# EAGLE design MRCS-555-Tone-Generator (EAGLE 7.7.0)
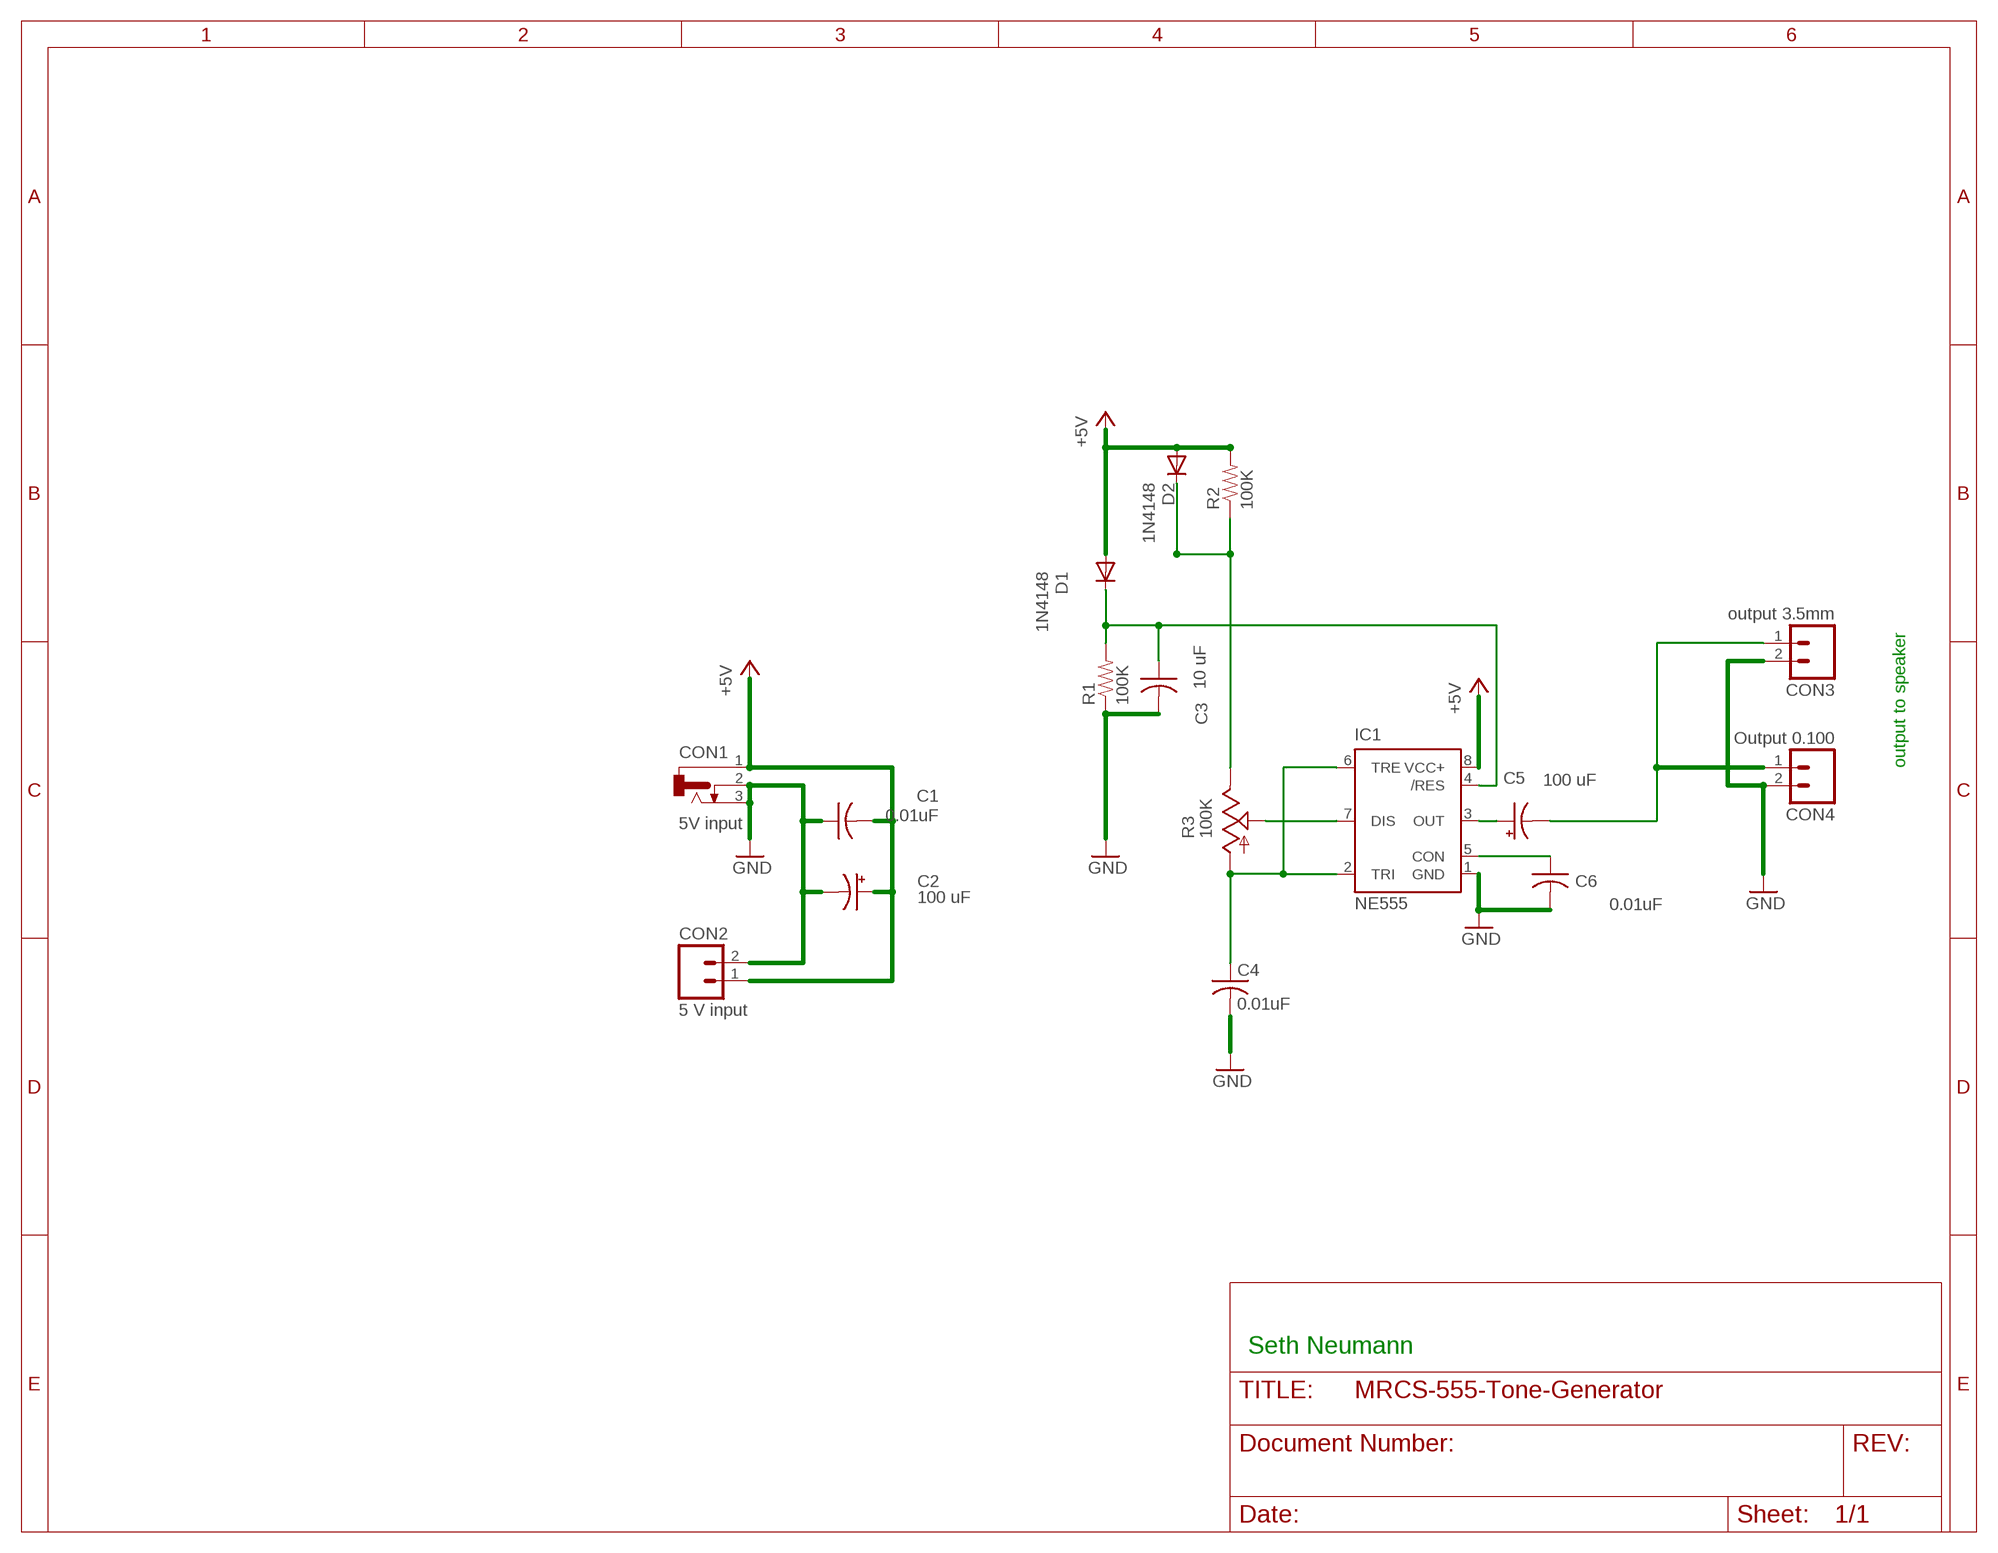
[diagram p0: schematic, sheet 1]

## Parts
C1  0.01uF  CAPPTH2  [C-PTH-0.100]
C2  100 uF  CAP-POLPTH-3.5MM  [E3.5-10]
C3  10 uF  CAPPTH2  [C-PTH-0.100]
C4  0.01uF  CAPPTH2  [C-PTH-0.100]
C5  100 uF  CAP-POLPTH-3.5MM  [E3.5-10]
C6  0.01uF  CAPPTH2  [C-PTH-0.100]
CON1  5V input  CONNECTOR-DC-POWER-RA  [DCJ0202]
CON2  5 V input  CONNECTOR-M021X02-LOCK  [1X02_LOCK]
CON3  output 3.5mm  CONNECTOR-M023.5MM-LOCK  [SCREWTERMINAL-3.5MM-2_LOCK]
CON4  Output 0.100  CONNECTOR-M021X02-LOCK  [1X02_LOCK]
D1  1N4148  DIODE1N4148  [DIODE-1N4148]
D2  1N4148  DIODE1N4148  [DIODE-1N4148]
IC1  NE555  NE555P  [DIL-08]
R1  100K  RPTH04  [AXIAL-0.4-RES]
R2  100K  RPTH04  [AXIAL-0.4-RES]
R3  100K  TRIM_US-RS3  [RS3]

## Nets
+5V: C1.2 C2.+ CON1.1 CON2.1(A) D1.A D2.A IC1.8(VCC+) R2.P$2
GND: C1.1 C2.- C3.2 C4.2 C6.2 CON1.2 CON1.3 CON2.2(B) CON3.2(B) CON4.2(B) IC1.1(GND) R1.P$1
N$1: C5.- CON3.1(A) CON4.1(A)
N$2: C6.1 IC1.5(CON)
N$3: C5.+ IC1.3(OUT)
N$4: C4.1 IC1.2(TRI) IC1.6(TRE) R3.A
N$5: D2.C R2.P$1 R3.E
N$6: C3.1 D1.C IC1.4(/RES) R1.P$2
N$7: IC1.7(DIS) R3.S

## Notes on the sheet
- output to speaker
- Seth Neumann

## Library data of the parts
C1 C3 C4 C6 = SPCoast:CAP*
C2 C5 = SPCoast:CAP-POL*
CON1 = SPCoast:CONNECTOR-DC-POWER: DC POWER JACK
CON2-CON4 = SPCoast:CONNECTOR-M02: PHOENIX CONNECTOR
D1 D2 = SPCoast:DIODE: Diode These are standard reverse protection diodes and small signal diodes. SMA package can handle up to about 1A. SOD-323 can handle about 200mA. What the SOD-323 package when ordering, there are some mfgs out there that are 5-pin packages.
IC1 = SPCoast:NE555: General purpose bipolar Timer; MF: Arrow Electronics; MPN: NE555N; OC_FARNELL: 1467742; OC_NEWARK: 89K1486
R1 R2 = SPCoast:R*: Resistor Basic schematic elements and footprints for 0603, 1206, and PTH 1/10th watt (small) resistors.
R3 = MRCS:TRIM_US-: POTENTIOMETER

## Board
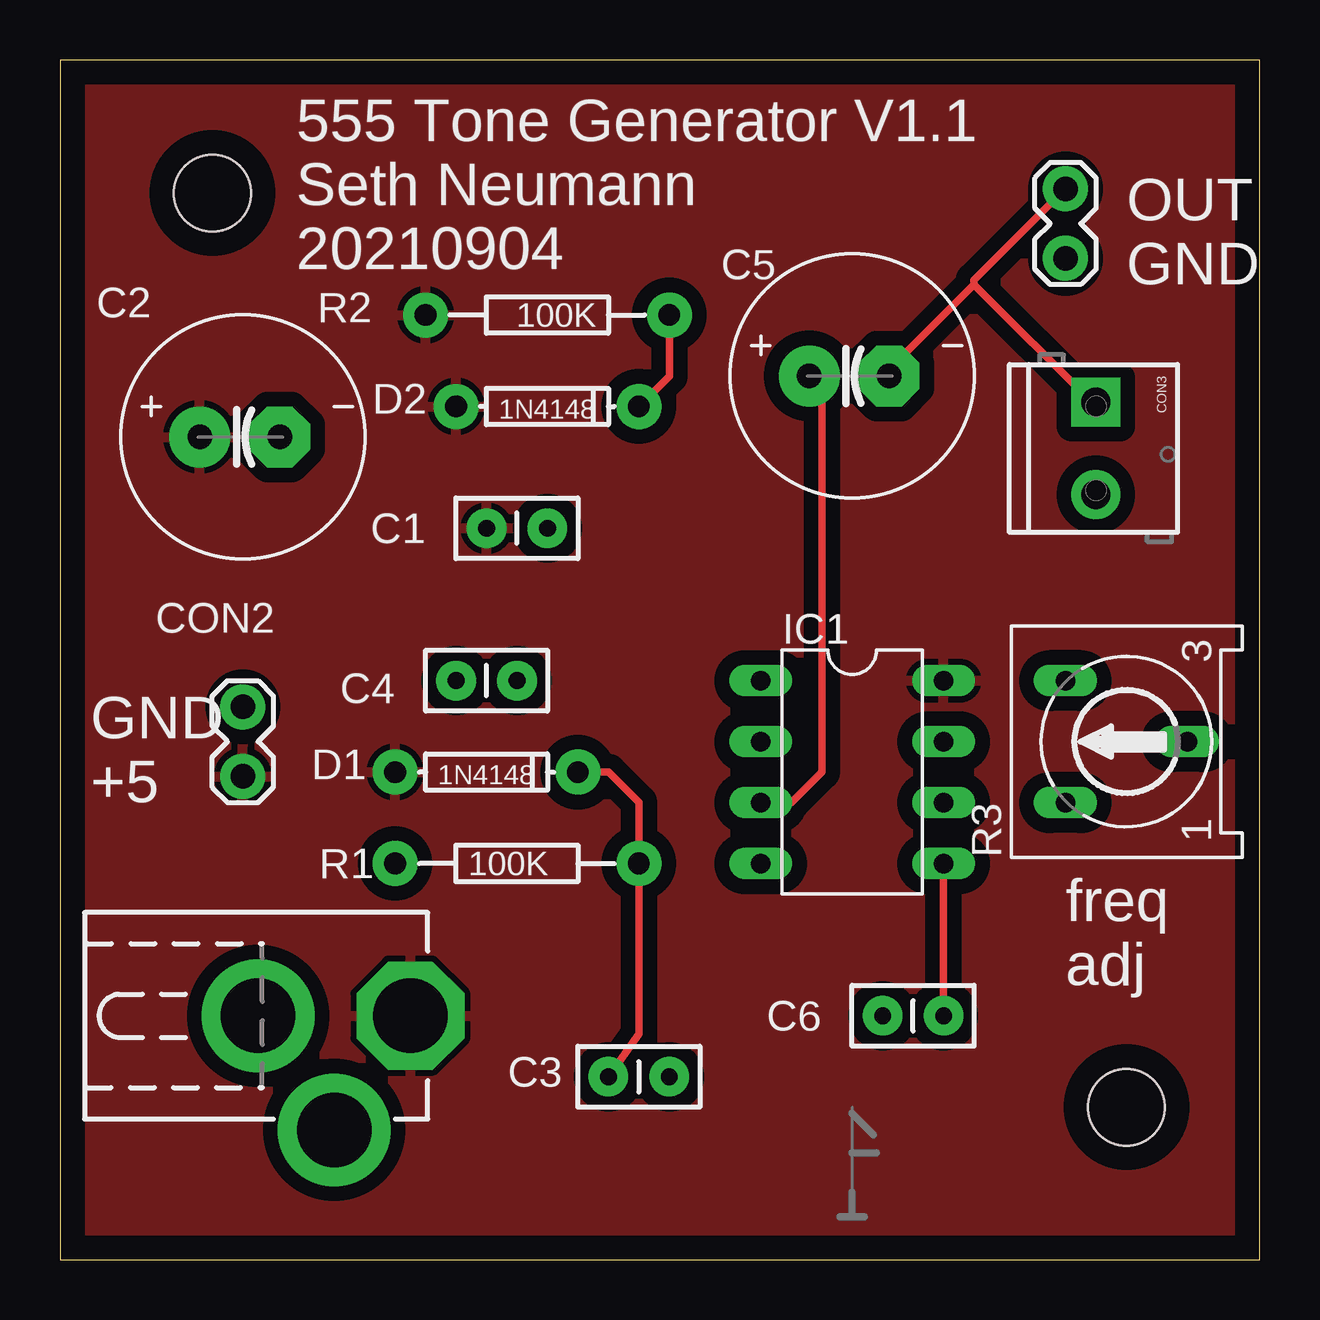
[diagram p1: board, top side]
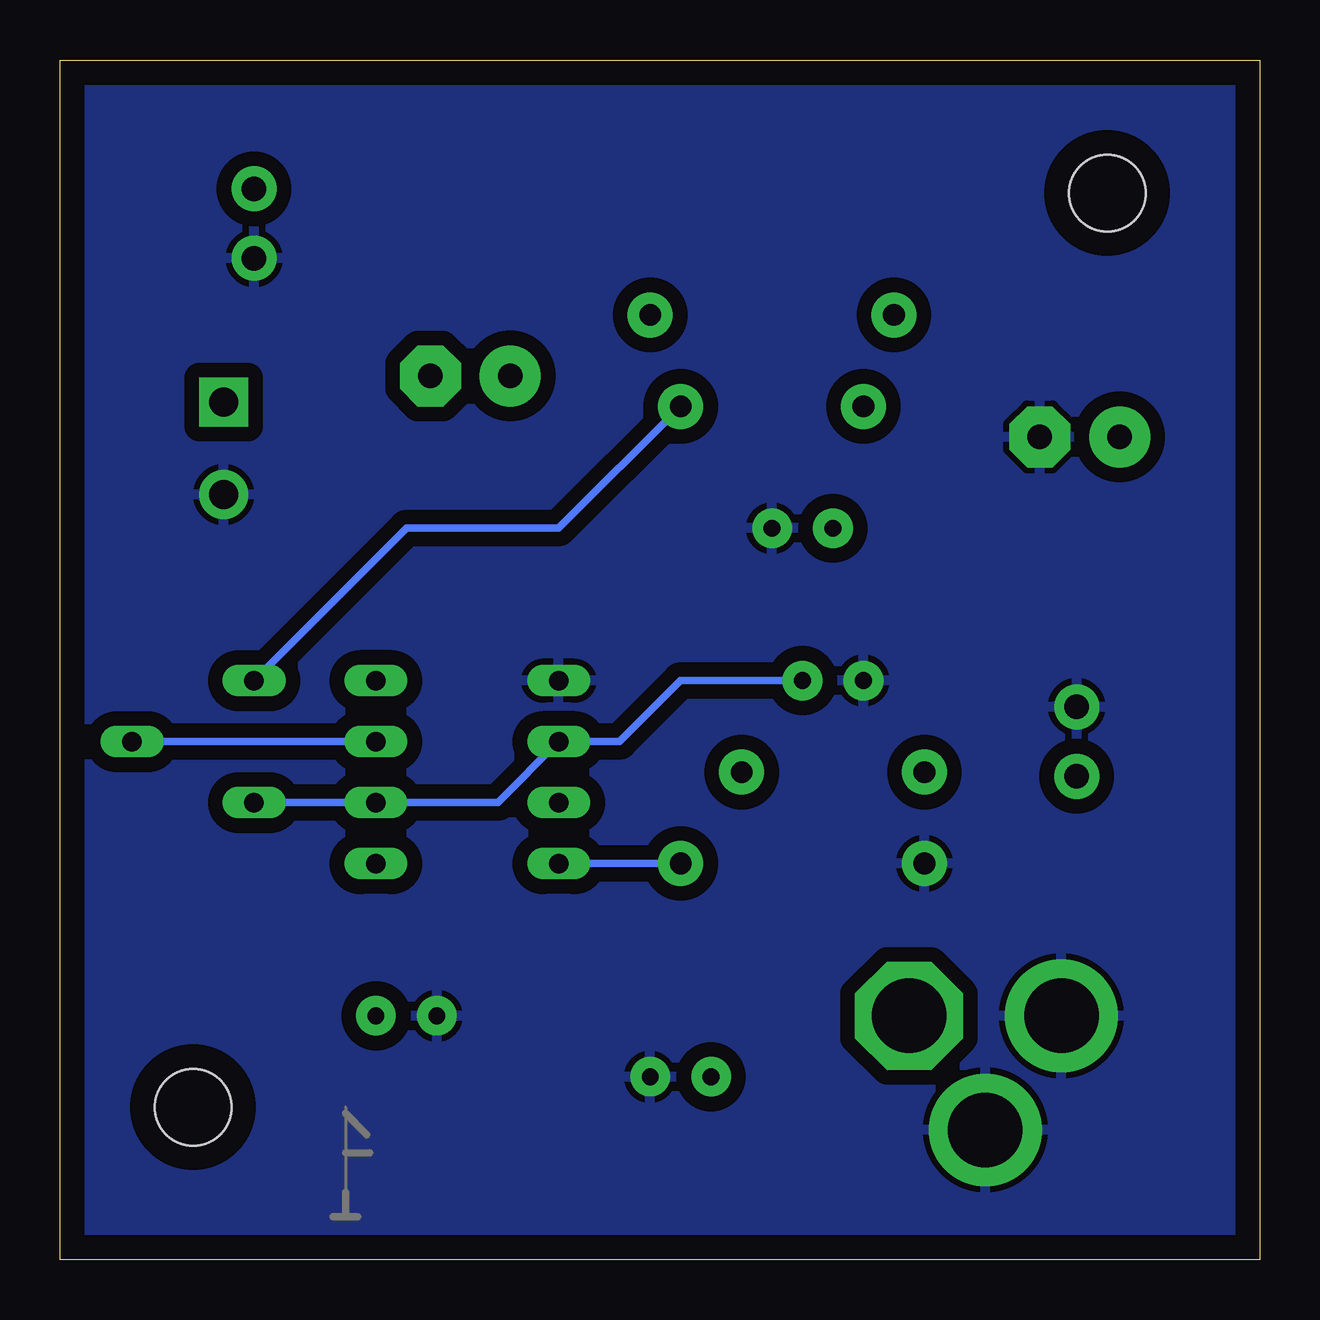
[diagram p2: board, bottom side, seen from below]

Size 50 x 50 mm. Coordinates in mm from the lower left corner, seen from the top.
Outline: 0,0 50,0 50,50 0,50 0,0
Copper layers (1*16): Top 0.035mm / dielectric 1.5mm / Bottom 0.035mm
Design rules "default": minimum track width 10mil, minimum drill 24mil, track to track 8mil, track to pad 8mil, pad to pad 8mil, via to via 8mil, smd to smd 8mil, copper to edge 40mil, drill to drill 8mil, minimum pad ring 10mil, minimum via ring 8mil, stop-mask expansion 4mil, vias tented up to drill 0mil, thermal gap 10mil
Holes 3.2 mm at 6.35,44.45 44.45,6.35

### Footprints (pad centres in the part's own frame; a part is rotated, then mirrored left to right if it is on the bottom)
C-PTH-0.100 = drill 0.7 pad 1.651: 1 -1.27,0; 2 1.27,0
E3.5-10 = drill 1.016 pad 2.54: + -1.79,0 | drill 1.016 pad 2.54 octagon: - 1.54,0
DCJ0202 = drill 3.1 pad 4.5 octagon: 1 0,3.175 | drill 3.1 pad 4.7: 2 4.763,0; 3 0,-3.175
1X02_LOCK = drill 1.016 pad 1.88: 1 -0.178,0; 2 2.718,0
SCREWTERMINAL-3.5MM-2_LOCK = drill 1.2 pad 2.032 square: 1 -0.178,0 | drill 1.2 pad 2.032: 2 3.678,0
DIODE-1N4148 = drill 0.9 pad 1.88: A 3.81,0; C -3.81,0
DIL-08 = drill 0.813 long: 1 -3.81,-3.81; 2 -1.27,-3.81; 3 1.27,-3.81; 4 3.81,-3.81; 5 3.81,3.81; 6 1.27,3.81; 7 -1.27,3.81; 8 -3.81,3.81
AXIAL-0.4-RES = drill 0.9 pad 1.88: P$1 -5.08,0; P$2 5.08,0
RS3 = drill 0.813 long: A -2.54,2.54; E 2.54,2.54; S 0,-2.54

### Placement (x,y rotation side)
C1  19.05,30.48 180 top
C2  7.62,34.29 0 top
C3  24.13,7.62 0 top
C4  17.78,24.13 180 top
C5  33.02,36.83 0 top
C6  35.56,10.16 180 top
CON1  11.43,10.16 270 top
CON2  7.62,20.32 90 top
CON3  43.18,35.56 270 top
CON4  41.91,44.45 270 top
D1  17.78,20.32 180 top
D2  20.32,35.56 180 top
IC1  33.02,20.32 270 top
R1  19.05,16.51 0 top
R2  20.32,39.37 180 top
R3  44.45,21.59 90 top
U$1  [MRCSLOGOTOP]  31.75,1.27 0 top
U$2  [MRCSLOGOBTM]  31.75,1.27 0 top
U$3  [CA-PROP65WARNING]  27.94,45.72 0 top

### Tracks (layer width: path | path; a pad name or v marks a point on that pad's centre or on a via)
+5V
  pour Top (isolate 0.61): 0,0 50,0 50,50 0,50
GND
  pour Bottom (isolate 0.61): 0,0 50,0 50,50 0,50
N$1
  Top 0.305: C5.- 34.56,37.1 38.1,40.64 | 38.1,40.64 38.1,40.82 CON4.1 | CON3.1 43,35.74 38.1,40.64
N$2
  Top 0.305: IC1.5 C6.1
N$3
  Top 0.305: IC1.3 30.48,19.05 31.75,20.32 31.75,36.31 C5.+
N$4
  Bottom 0.305: R3.A IC1.6 31.75,19.05 IC1.2 26.67,21.59 24.13,24.13 C4.1
N$5
  Top 0.305: R2.P$1 25.4,36.83 D2.C
  Bottom 0.305: D2.C 29.21,30.48 35.56,30.48 R3.E
N$6
  Top 0.305: D1.C 22.86,20.32 24.13,19.05 R1.P$2 24.13,9.41 C3.1
  Bottom 0.305: R1.P$2 IC1.4
N$7
  Bottom 0.305: R3.S IC1.7

### Text on the board
tPlace: 555 Tone Generator V1.1 / Seth Neumann / 20210904 | OUT / GND | GND / +5 | freq / adj